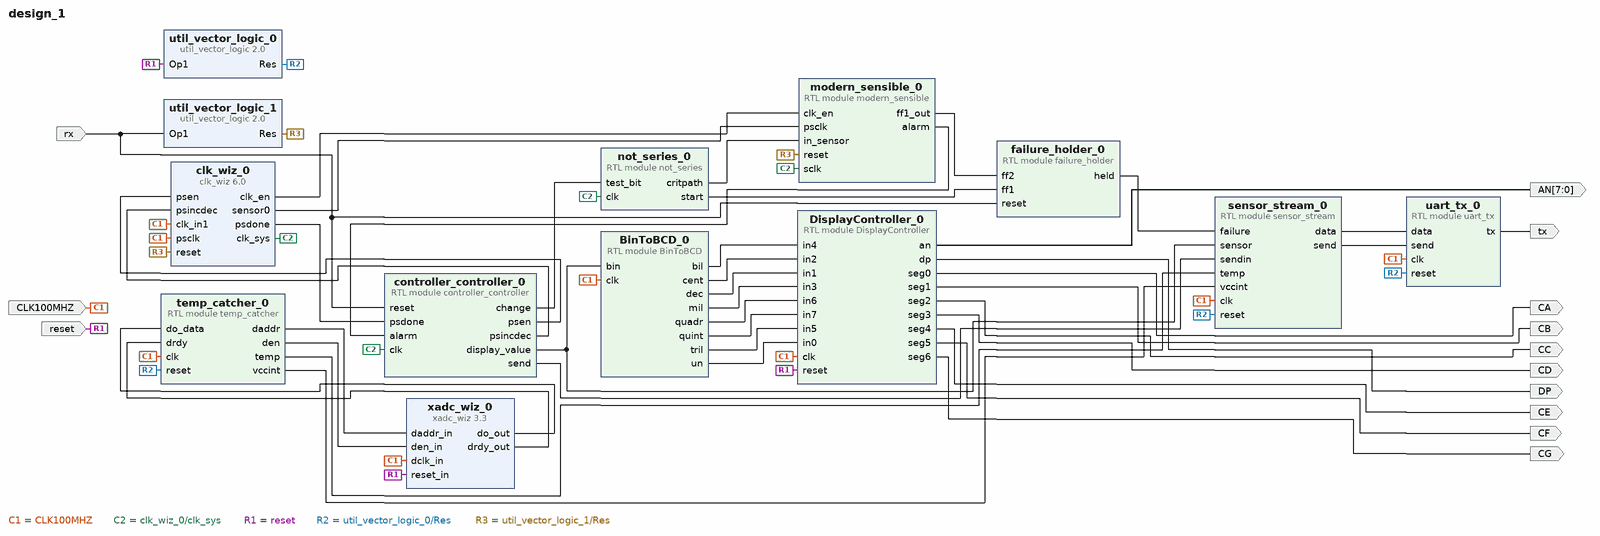
[diagram p0: block diagram of the top level]
# Vivado block design design_1, xc7a100tcsg324-1, Vivado 2025.2.1
create_bd_design design_1

create_bd_port -dir O CA
create_bd_port -dir O CB
create_bd_port -dir O CC
create_bd_port -dir O CD
create_bd_port -dir O CE
create_bd_port -dir O CF
create_bd_port -dir O CG
create_bd_port -dir O DP
create_bd_port -dir O -from 7 -to 0 AN
create_bd_port -dir I reset
create_bd_port -dir O tx
create_bd_port -dir I -type clk CLK100MHZ
set_property -dict {CONFIG.FREQ_HZ 100000000} [get_bd_ports CLK100MHZ]
create_bd_port -dir I rx

create_bd_cell -type ip -vlnv xilinx.com:ip:xadc_wiz:3.3 xadc_wiz_0
set_property -dict [list \
  CONFIG.ADC_CONVERSION_RATE 385 \
  CONFIG.CHANNEL_ENABLE_TEMPERATURE true \
  CONFIG.CHANNEL_ENABLE_VCCINT true \
  CONFIG.CHANNEL_ENABLE_VP_VN false \
  CONFIG.DCLK_FREQUENCY 100 \
  CONFIG.ENABLE_RESET true \
  CONFIG.EXTERNAL_MUX_CHANNEL VP_VN \
  CONFIG.INTERFACE_SELECTION ENABLE_DRP \
  CONFIG.OT_ALARM false \
  CONFIG.SEQUENCER_MODE Continuous \
  CONFIG.SINGLE_CHANNEL_SELECTION TEMPERATURE \
  CONFIG.TIMING_MODE Continuous \
  CONFIG.USER_TEMP_ALARM true \
  CONFIG.VCCAUX_ALARM true \
  CONFIG.VCCINT_ALARM true \
  CONFIG.XADC_STARUP_SELECTION channel_sequencer \
] [get_bd_cells xadc_wiz_0]
create_bd_cell -type module -reference BinToBCD BinToBCD_0
create_bd_cell -type module -reference DisplayController DisplayController_0
create_bd_cell -type ip -vlnv xilinx.com:ip:util_vector_logic:2.0 util_vector_logic_0
set_property -dict {CONFIG.C_OPERATION not CONFIG.C_SIZE 1} [get_bd_cells util_vector_logic_0]
create_bd_cell -type module -reference temp_catcher temp_catcher_0
create_bd_cell -type module -reference modern_sensible modern_sensible_0
create_bd_cell -type ip -vlnv xilinx.com:ip:clk_wiz:6.0 clk_wiz_0
set_property -dict [list \
  CONFIG.CLKOUT1_DRIVES BUFGCE \
  CONFIG.CLKOUT1_JITTER 137.681 \
  CONFIG.CLKOUT1_PHASE_ERROR 105.461 \
  CONFIG.CLKOUT1_REQUESTED_OUT_FREQ 100.000 \
  CONFIG.CLKOUT1_REQUESTED_PHASE 100 \
  CONFIG.CLKOUT2_DRIVES BUFGCE \
  CONFIG.CLKOUT2_JITTER 137.681 \
  CONFIG.CLKOUT2_PHASE_ERROR 105.461 \
  CONFIG.CLKOUT2_REQUESTED_OUT_FREQ 100.000 \
  CONFIG.CLKOUT2_REQUESTED_PHASE 0.000 \
  CONFIG.CLKOUT2_USED true \
  CONFIG.CLKOUT3_DRIVES BUFGCE \
  CONFIG.CLKOUT3_JITTER 137.681 \
  CONFIG.CLKOUT3_PHASE_ERROR 105.461 \
  CONFIG.CLKOUT3_REQUESTED_OUT_FREQ 100.000 \
  CONFIG.CLKOUT3_REQUESTED_PHASE 0.000 \
  CONFIG.CLKOUT3_USED true \
  CONFIG.CLKOUT4_DRIVES BUFGCE \
  CONFIG.CLKOUT4_JITTER 137.681 \
  CONFIG.CLKOUT4_PHASE_ERROR 105.461 \
  CONFIG.CLKOUT4_REQUESTED_PHASE 0.000 \
  CONFIG.CLKOUT4_USED false \
  CONFIG.CLKOUT5_DRIVES BUFGCE \
  CONFIG.CLKOUT5_JITTER 137.681 \
  CONFIG.CLKOUT5_PHASE_ERROR 105.461 \
  CONFIG.CLKOUT5_REQUESTED_PHASE 0.000 \
  CONFIG.CLKOUT5_USED false \
  CONFIG.CLKOUT6_DRIVES BUFGCE \
  CONFIG.CLKOUT6_JITTER 137.681 \
  CONFIG.CLKOUT6_PHASE_ERROR 105.461 \
  CONFIG.CLKOUT6_REQUESTED_PHASE 0.000 \
  CONFIG.CLKOUT6_USED false \
  CONFIG.CLKOUT7_DRIVES BUFGCE \
  CONFIG.CLKOUT7_JITTER 137.681 \
  CONFIG.CLKOUT7_PHASE_ERROR 105.461 \
  CONFIG.CLKOUT7_REQUESTED_PHASE 0.000 \
  CONFIG.CLKOUT7_USED false \
  CONFIG.CLK_IN1_BOARD_INTERFACE Custom \
  CONFIG.CLK_IN2_BOARD_INTERFACE Custom \
  CONFIG.CLK_OUT1_PORT clk_en \
  CONFIG.CLK_OUT2_PORT sensor0 \
  CONFIG.CLK_OUT2_USE_FINE_PS_GUI true \
  CONFIG.CLK_OUT3_PORT clk_sys \
  CONFIG.CLK_OUT4_PORT clk_out4 \
  CONFIG.CLK_OUT5_PORT clk_out5 \
  CONFIG.CLK_OUT6_PORT clk_out6 \
  CONFIG.CLK_OUT7_PORT clk_out7 \
  CONFIG.FEEDBACK_SOURCE FDBK_AUTO \
  CONFIG.MMCM_CLKFBOUT_MULT_F 9.000 \
  CONFIG.MMCM_CLKOUT0_DIVIDE_F 9.000 \
  CONFIG.MMCM_CLKOUT0_PHASE 100.000 \
  CONFIG.MMCM_CLKOUT1_DIVIDE 9 \
  CONFIG.MMCM_CLKOUT1_PHASE 0.000 \
  CONFIG.MMCM_CLKOUT1_USE_FINE_PS true \
  CONFIG.MMCM_CLKOUT2_DIVIDE 9 \
  CONFIG.MMCM_CLKOUT2_PHASE 0.000 \
  CONFIG.MMCM_CLKOUT3_DIVIDE 1 \
  CONFIG.MMCM_CLKOUT3_PHASE 0.000 \
  CONFIG.MMCM_CLKOUT4_DIVIDE 1 \
  CONFIG.MMCM_CLKOUT4_PHASE 0.000 \
  CONFIG.MMCM_CLKOUT5_DIVIDE 1 \
  CONFIG.MMCM_CLKOUT5_PHASE 0.000 \
  CONFIG.MMCM_CLKOUT6_DIVIDE 1 \
  CONFIG.MMCM_CLKOUT6_PHASE 0.000 \
  CONFIG.MMCM_DIVCLK_DIVIDE 1 \
  CONFIG.NUM_OUT_CLKS 3 \
  CONFIG.PRIM_SOURCE No_buffer \
  CONFIG.RESET_BOARD_INTERFACE Custom \
  CONFIG.USE_DYN_PHASE_SHIFT true \
  CONFIG.USE_FREQ_SYNTH false \
  CONFIG.USE_LOCKED false \
  CONFIG.USE_SAFE_CLOCK_STARTUP true \
] [get_bd_cells clk_wiz_0]
create_bd_cell -type module -reference not_series not_series_0
set_property -dict {CONFIG.size 50} [get_bd_cells not_series_0]
create_bd_cell -type module -reference sensor_stream sensor_stream_0
create_bd_cell -type module -reference uart_tx uart_tx_0
create_bd_cell -type module -reference controller_controller controller_controller_0
create_bd_cell -type ip -vlnv xilinx.com:ip:util_vector_logic:2.0 util_vector_logic_1
set_property -dict {CONFIG.C_OPERATION not CONFIG.C_SIZE 1} [get_bd_cells util_vector_logic_1]
create_bd_cell -type module -reference failure_holder failure_holder_0

# ---- connections ----

connect_bd_net [get_bd_pins BinToBCD_0/bil] [get_bd_pins DisplayController_0/in4]
connect_bd_net [get_bd_pins BinToBCD_0/cent] [get_bd_pins DisplayController_0/in2]
connect_bd_net [get_bd_pins BinToBCD_0/dec] [get_bd_pins DisplayController_0/in1]
connect_bd_net [get_bd_pins BinToBCD_0/mil] [get_bd_pins DisplayController_0/in3]
connect_bd_net [get_bd_pins BinToBCD_0/quadr] [get_bd_pins DisplayController_0/in6]
connect_bd_net [get_bd_pins BinToBCD_0/quint] [get_bd_pins DisplayController_0/in7]
connect_bd_net [get_bd_pins BinToBCD_0/tril] [get_bd_pins DisplayController_0/in5]
connect_bd_net [get_bd_pins BinToBCD_0/un] [get_bd_pins DisplayController_0/in0]
connect_bd_net [get_bd_ports CLK100MHZ] \
  [get_bd_pins BinToBCD_0/clk] [get_bd_pins DisplayController_0/clk] [get_bd_pins uart_tx_0/clk] \
  [get_bd_pins temp_catcher_0/clk] [get_bd_pins sensor_stream_0/clk] [get_bd_pins clk_wiz_0/clk_in1] \
  [get_bd_pins clk_wiz_0/psclk] [get_bd_pins xadc_wiz_0/dclk_in]
connect_bd_net -net Dff_0_ffoutput [get_bd_pins controller_controller_0/display_value] \
  [get_bd_pins BinToBCD_0/bin] [get_bd_pins sensor_stream_0/sensor]
connect_bd_net [get_bd_pins DisplayController_0/an] [get_bd_ports AN]
connect_bd_net [get_bd_pins DisplayController_0/dp] [get_bd_ports DP]
connect_bd_net [get_bd_pins DisplayController_0/seg0] [get_bd_ports CA]
connect_bd_net [get_bd_pins DisplayController_0/seg1] [get_bd_ports CB]
connect_bd_net [get_bd_pins DisplayController_0/seg2] [get_bd_ports CC]
connect_bd_net [get_bd_pins DisplayController_0/seg3] [get_bd_ports CD]
connect_bd_net [get_bd_pins DisplayController_0/seg4] [get_bd_ports CE]
connect_bd_net [get_bd_pins DisplayController_0/seg5] [get_bd_ports CF]
connect_bd_net [get_bd_pins DisplayController_0/seg6] [get_bd_ports CG]
connect_bd_net -net button_2 [get_bd_ports rx] \
  [get_bd_pins controller_controller_0/reset] [get_bd_pins failure_holder_0/reset] [get_bd_pins util_vector_logic_1/Op1]
connect_bd_net [get_bd_pins clk_wiz_0/clk_en] [get_bd_pins modern_sensible_0/clk_en]
connect_bd_net -net clk_wiz_0_clk_orig [get_bd_pins clk_wiz_0/clk_sys] \
  [get_bd_pins not_series_0/clk] [get_bd_pins controller_controller_0/clk] [get_bd_pins modern_sensible_0/sclk]
connect_bd_net [get_bd_pins clk_wiz_0/psdone] [get_bd_pins controller_controller_0/psdone]
connect_bd_net [get_bd_pins clk_wiz_0/sensor0] [get_bd_pins modern_sensible_0/psclk]
connect_bd_net [get_bd_pins controller_controller_0/change] [get_bd_pins not_series_0/test_bit]
connect_bd_net [get_bd_pins controller_controller_0/psen] [get_bd_pins clk_wiz_0/psen]
connect_bd_net [get_bd_pins controller_controller_0/psincdec] [get_bd_pins clk_wiz_0/psincdec]
connect_bd_net [get_bd_pins controller_controller_0/send] [get_bd_pins sensor_stream_0/sendin]
connect_bd_net [get_bd_pins failure_holder_0/held] [get_bd_pins sensor_stream_0/failure]
connect_bd_net [get_bd_pins modern_sensible_0/alarm] [get_bd_pins controller_controller_0/alarm]
connect_bd_net [get_bd_pins modern_sensible_0/ff1_out] [get_bd_pins failure_holder_0/ff2]
connect_bd_net [get_bd_pins not_series_0/critpath] [get_bd_pins modern_sensible_0/in_sensor]
connect_bd_net [get_bd_pins not_series_0/start] [get_bd_pins failure_holder_0/ff1]
connect_bd_net [get_bd_ports reset] [get_bd_pins DisplayController_0/reset] [get_bd_pins util_vector_logic_0/Op1] [get_bd_pins xadc_wiz_0/reset_in]
connect_bd_net [get_bd_pins sensor_stream_0/data] [get_bd_pins uart_tx_0/data]
connect_bd_net [get_bd_pins sensor_stream_0/send] [get_bd_pins uart_tx_0/send]
connect_bd_net [get_bd_pins temp_catcher_0/daddr] [get_bd_pins xadc_wiz_0/daddr_in]
connect_bd_net [get_bd_pins temp_catcher_0/den] [get_bd_pins xadc_wiz_0/den_in]
connect_bd_net [get_bd_pins temp_catcher_0/temp] [get_bd_pins sensor_stream_0/temp]
connect_bd_net [get_bd_pins temp_catcher_0/vccint] [get_bd_pins sensor_stream_0/vccint]
connect_bd_net [get_bd_pins uart_tx_0/tx] [get_bd_ports tx]
connect_bd_net [get_bd_pins util_vector_logic_0/Res] \
  [get_bd_pins uart_tx_0/reset] [get_bd_pins temp_catcher_0/reset] [get_bd_pins sensor_stream_0/reset]
connect_bd_net [get_bd_pins util_vector_logic_1/Res] [get_bd_pins modern_sensible_0/reset] [get_bd_pins clk_wiz_0/reset]
connect_bd_net [get_bd_pins xadc_wiz_0/do_out] [get_bd_pins temp_catcher_0/do_data]
connect_bd_net [get_bd_pins xadc_wiz_0/drdy_out] [get_bd_pins temp_catcher_0/drdy]

validate_bd_design
save_bd_design
